# Altium project swd_isol.PrjPCB
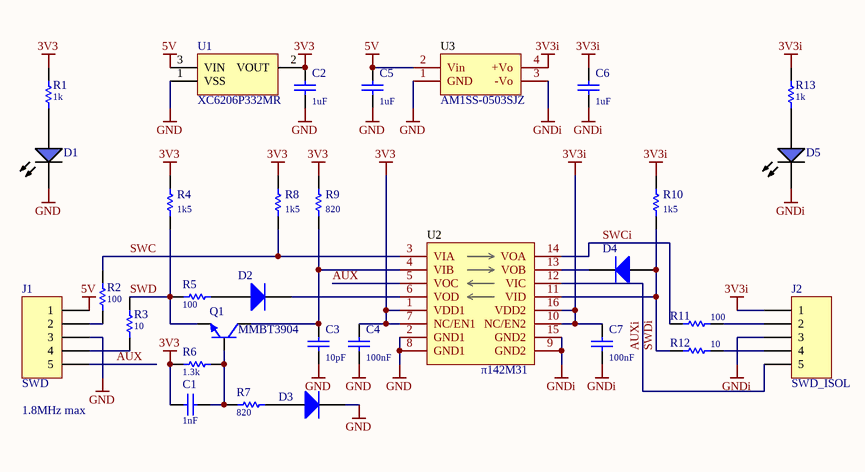
[diagram p0: schematic.SchDoc]
PRJ_ID: -; PRJ_VER: v1.0.0
1 sheet, 31 parts. Net scope: global (net labels, ports and power ports of the same name join across sheets).
Board file: board.PcbDoc

## Sheet schematic.SchDoc: SWD Isolator
size A4; Revision: 1; SheetNumber: 6; SheetTotal: 29

### Parts
C1  1nF  [C0603]  (no BOM)
C2  1uF  [C0603]
C3  10pF  [C0603]  (no BOM)
C4  100nF  [C0603]
C5  1uF  [C0805]
C6  1uF  [C0603]
C7  100nF  [C0603]
D1  BLU  [LED-0603-BLU]  (value not drawn)
D2  DIODE  [SOD-123FL]  (value not drawn)
D3  SCHOTTKY DIODE  [SOD-123FL]  (value not drawn)
D4  SCHOTTKY DIODE  [SOD-123FL]  (value not drawn)
D5  BLU  [LED-0603-BLU]  (value not drawn)
J1  SWD  [HDR-1X5_2.54]
J2  SWD_ISOL  [HDR-1X5_2.54]
Q1  MMBT3904  [SOT-23]
R1  1k  [R0603]
R2  100  [R0603]
R3  10  [R0603]
R4  1k5  [R0603]
R5  100  [R0603]
R6  1.3k  [R0603]
R7  820  [R0603]
R8  1k5  [R0603]
R9  820  [R0603]
R10  1k5  [R0603]
R11  100  [R0603]
R12  10  [R0603]
R13  1k  [R0603]
U1  XC6206P332MR  [SOT-23]
U2  π142M31  [SOIC-16]
U3  AM1SS-0503SJZ  [PWRM-TH_B2405S-1WR2]

### Nets
3V3: C1.2 C2.2 C4.2 R1.2 R4.2 R6.2 R8.2 R9.2 U1.2(VOUT) U2.1(VDD1) U2.7(NC/EN1)
3V3i: C6.2 C7.2 J2.1 R10.2 R13.2 U2.10(NC/EN2) U2.16(VDD2) U3.4(+Vo)
5V: C5.2 J1.1 U1.3(VIN) U3.2(Vin)
GND: C2.1 C3.1 C4.1 C5.1 D1.2(K) D3.2(K) J1.3 U1.1(VSS) U2.2(GND1) U2.8(GND1) U3.1(GND)
GNDi: C6.1 C7.1 D5.2(K) J2.3 U2.9(GND2) U2.15(GND2) U3.3(-Vo)
AUX: J1.5 U2.5(VOC)
AUXi: J2.5 U2.12(VIC)
SWC: R2.2 R8.1 U2.3(VIA)
SWCi: R11.2 U2.14(VOA)
SWD: Q1.2(E) R3.1 R4.1 R5.2
SWDi: D4.1(A) R10.1 R12.2 U2.11(VID)
NetC1_1: C1.1 Q1.1(B) R6.1 R7.2
NetC3_2: C3.2 Q1.3(C) R9.1 U2.4(VIB)
NetD1_1: D1.1(A) R1.1
NetD2_1: D2.1(A) R5.1
NetD2_2: D2.2(K) U2.6(VOD)
NetD3_1: D3.1(A) R7.1
NetD4_2: D4.2(K) U2.13(VOB)
NetD5_1: D5.1(A) R13.1
NetJ1_2: J1.2 R2.1
NetJ1_4: J1.4 R3.2
NetJ2_2: J2.2 R11.1
NetJ2_4: J2.4 R12.1

### Notes on the sheet
- (near J1) 1.8MHz max

### Library data of the parts
C1 C3 C4 C7 = CAP: 100nF 50V 0603
C2 C6 = CAP: 1uF 50V 0603
C5 = CAP: 1uF 50V 0805
D1 D5 = LED-0603-BLUE: DIODE LED 0603 BLUE
D2-D4 = US1M-13-F
J1 J2 = CONN MOLEX HDR-M 1x4
Q1 = MMBT2222ALT1G: MMBT3904 "1AM"
R1 R13 = RES: 1k 0603
R2 R11 = RES: 100 0603
R3 R12 = RES: 10 0603
R4 R8 R10 = RES: 1.5k 0603
R5 = RES: 100R 0603
R6 = RES: 1.3k 0603
R7 R9 = RES: 820 0603
U1 = Component_4_1
U3 = B0503S-1WR2